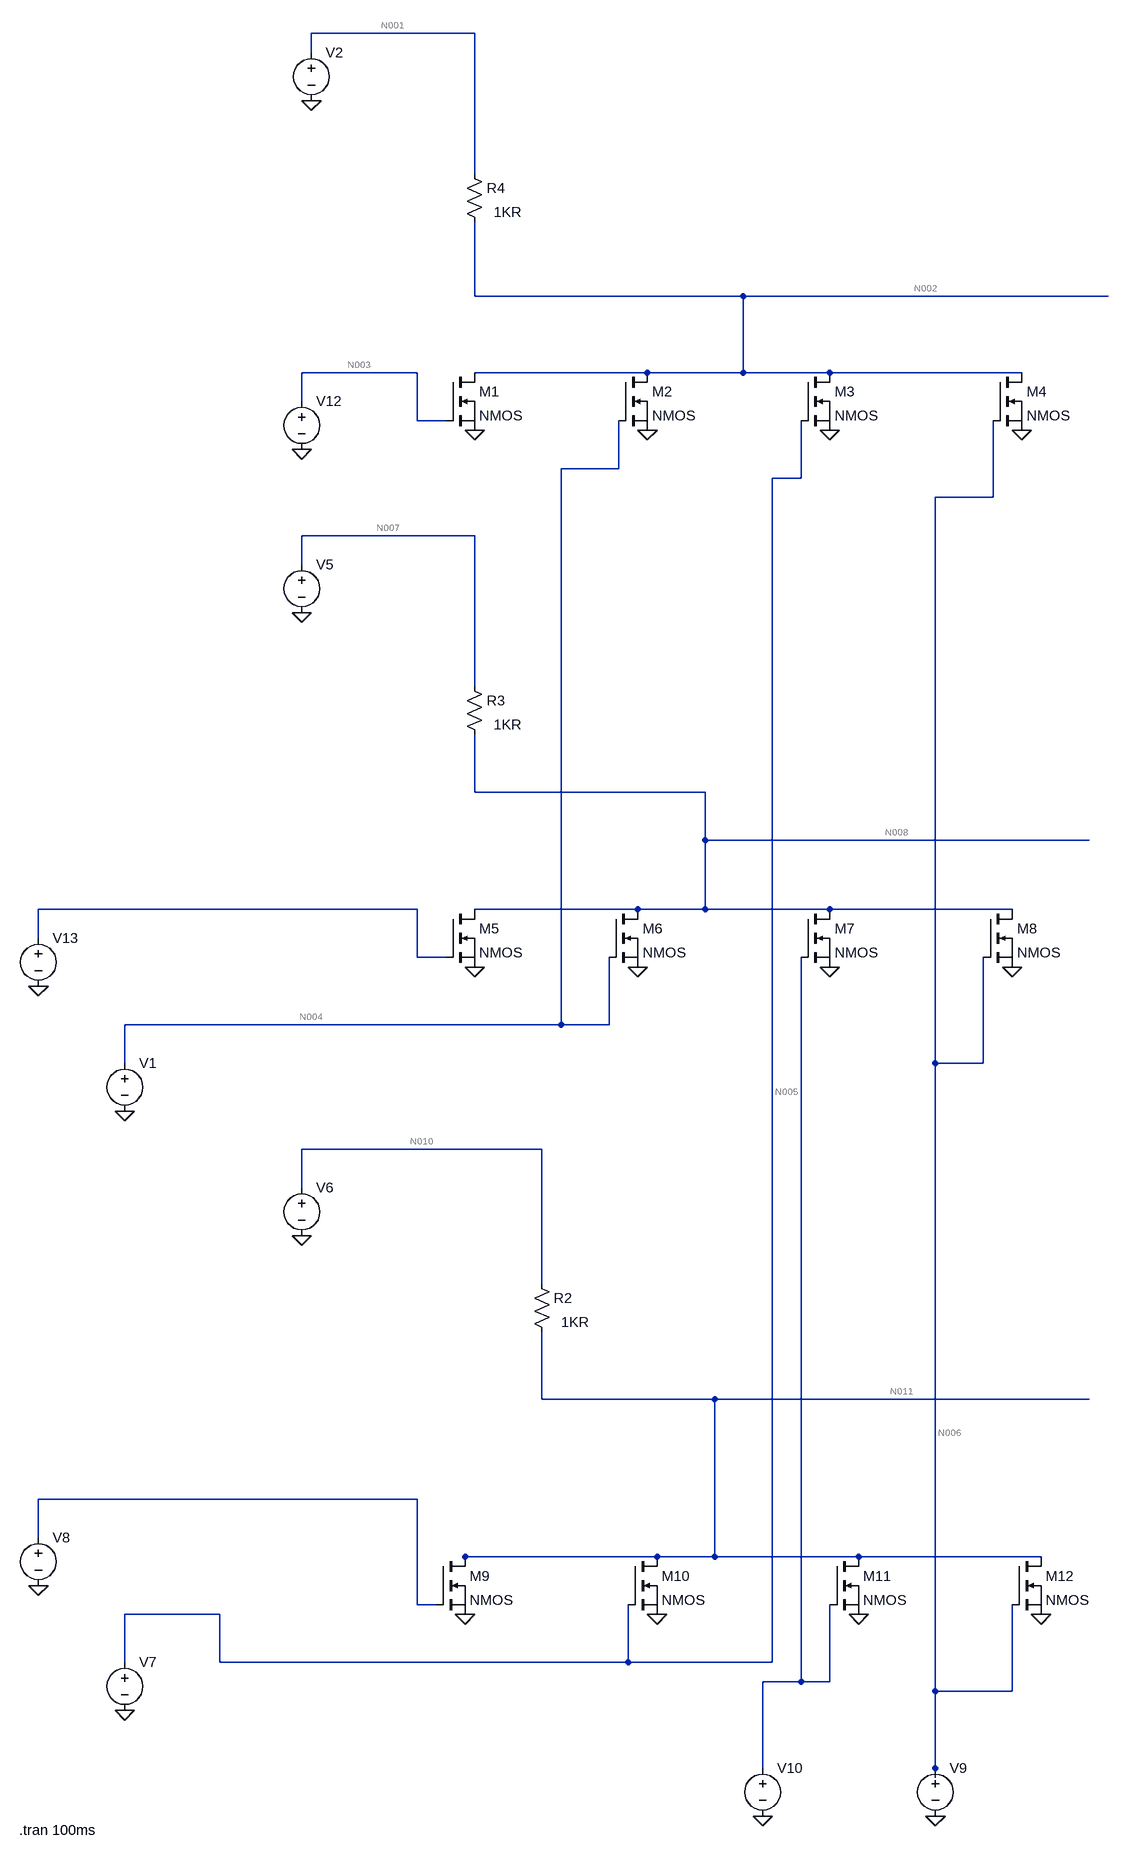
[diagram p0: schematic nmos.asc]
nmos.asc, the LTspice schematic file:
Version 4
SHEET 1 3732 3000
WIRE -1248 -656 -1520 -656
WIRE -1520 -624 -1520 -656
WIRE -1248 -272 -1248 -656
WIRE -1248 64 -1248 -192
WIRE -800 64 -1248 64
WIRE -192 64 -800 64
WIRE -1344 256 -1536 256
WIRE -960 256 -1248 256
WIRE -800 256 -800 64
WIRE -800 256 -960 256
WIRE -656 256 -800 256
WIRE -336 256 -656 256
WIRE -1536 304 -1536 256
WIRE -1344 336 -1344 256
WIRE -1296 336 -1344 336
WIRE -1008 416 -1008 336
WIRE -1008 416 -1104 416
WIRE -704 432 -704 336
WIRE -704 432 -752 432
WIRE -384 464 -384 336
WIRE -384 464 -480 464
WIRE -1248 528 -1536 528
WIRE -1536 576 -1536 528
WIRE -1248 864 -1248 528
WIRE -1248 1040 -1248 944
WIRE -864 1040 -1248 1040
WIRE -864 1120 -864 1040
WIRE -224 1120 -864 1120
WIRE -1344 1264 -2080 1264
WIRE -976 1264 -1248 1264
WIRE -864 1264 -864 1120
WIRE -864 1264 -976 1264
WIRE -656 1264 -864 1264
WIRE -352 1264 -656 1264
WIRE -2080 1312 -2080 1264
WIRE -1344 1344 -1344 1264
WIRE -1296 1344 -1344 1344
WIRE -1104 1456 -1104 416
WIRE -1104 1456 -1936 1456
WIRE -1024 1456 -1024 1344
WIRE -1024 1456 -1104 1456
WIRE -1936 1520 -1936 1456
WIRE -480 1520 -480 464
WIRE -400 1520 -400 1344
WIRE -400 1520 -480 1520
WIRE -1136 1664 -1536 1664
WIRE -1536 1728 -1536 1664
WIRE -1136 1888 -1136 1664
WIRE -1136 2080 -1136 1968
WIRE -848 2080 -1136 2080
WIRE -224 2080 -848 2080
WIRE -1344 2432 -2080 2432
WIRE -2080 2496 -2080 2432
WIRE -944 2528 -1264 2528
WIRE -848 2528 -848 2080
WIRE -848 2528 -944 2528
WIRE -608 2528 -848 2528
WIRE -304 2528 -608 2528
WIRE -1264 2544 -1264 2528
WIRE -1344 2608 -1344 2432
WIRE -1312 2608 -1344 2608
WIRE -1776 2624 -1936 2624
WIRE -1936 2704 -1936 2624
WIRE -1776 2704 -1776 2624
WIRE -992 2704 -992 2608
WIRE -992 2704 -1776 2704
WIRE -752 2704 -752 432
WIRE -752 2704 -992 2704
WIRE -704 2736 -704 1344
WIRE -704 2736 -768 2736
WIRE -656 2736 -656 2608
WIRE -656 2736 -704 2736
WIRE -480 2752 -480 1520
WIRE -352 2752 -352 2608
WIRE -352 2752 -480 2752
WIRE -768 2880 -768 2736
WIRE -480 2880 -480 2752
WIRE -480 2896 -480 2880
FLAG -2080 1392 0
FLAG -1936 1600 0
FLAG -1536 1808 0
FLAG -1248 1360 0
FLAG -976 1360 0
FLAG -656 1360 0
FLAG -1536 384 0
FLAG -1248 352 0
FLAG -960 352 0
FLAG -656 352 0
FLAG -336 352 0
FLAG -1520 -544 0
FLAG -2080 2576 0
FLAG -1936 2784 0
FLAG -768 2960 0
FLAG -480 2960 0
FLAG -304 2624 0
FLAG -608 2624 0
FLAG -944 2624 0
FLAG -1264 2624 0
FLAG -352 1360 0
FLAG -1536 656 0
SYMBOL nmos -1296 256 R0
SYMATTR InstName M1
SYMBOL nmos -1008 256 R0
SYMATTR InstName M2
SYMBOL nmos -704 256 R0
SYMATTR InstName M3
SYMBOL nmos -384 256 R0
SYMATTR InstName M4
SYMBOL nmos -1296 1264 R0
SYMATTR InstName M5
SYMBOL nmos -1024 1264 R0
SYMATTR InstName M6
SYMBOL nmos -704 1264 R0
SYMATTR InstName M7
SYMBOL nmos -400 1264 R0
SYMATTR InstName M8
SYMBOL nmos -1312 2528 R0
SYMATTR InstName M9
SYMBOL nmos -992 2528 R0
SYMATTR InstName M10
SYMBOL nmos -656 2528 R0
SYMATTR InstName M11
SYMBOL nmos -352 2528 R0
SYMATTR InstName M12
SYMBOL voltage -1936 1504 R0
WINDOW 3 24 96 Invisible 2
WINDOW 123 0 0 Left 0
WINDOW 39 0 0 Left 0
SYMATTR Value PULSE(0 1.8 24ms 0 0 10ms 100ms 1)
SYMATTR InstName V1
SYMBOL voltage -1520 -640 R0
WINDOW 3 24 96 Invisible 2
WINDOW 123 0 0 Left 0
WINDOW 39 0 0 Left 0
SYMATTR Value -1.8
SYMATTR InstName V2
SYMBOL voltage -1536 560 R0
WINDOW 3 24 96 Invisible 2
WINDOW 123 0 0 Left 0
WINDOW 39 0 0 Left 0
SYMATTR Value -1.8
SYMATTR InstName V5
SYMBOL voltage -1536 1712 R0
WINDOW 3 24 96 Invisible 2
WINDOW 123 0 0 Left 0
WINDOW 39 0 0 Left 0
SYMATTR Value -1.8
SYMATTR InstName V6
SYMBOL voltage -1936 2688 R0
WINDOW 3 24 96 Invisible 2
WINDOW 123 0 0 Left 0
WINDOW 39 0 0 Left 0
SYMATTR Value PULSE(0 1.8 48ms 0 0 10ms 100ms 1)
SYMATTR InstName V7
SYMBOL voltage -2080 2480 R0
WINDOW 3 24 96 Invisible 2
WINDOW 123 0 0 Left 0
WINDOW 39 0 0 Left 0
SYMATTR Value PULSE(0 1.8 36ms 0 0 10ms 100ms 1)
SYMATTR InstName V8
SYMBOL voltage -480 2864 R0
WINDOW 3 24 96 Invisible 2
WINDOW 123 0 0 Left 0
WINDOW 39 0 0 Left 0
SYMATTR Value PULSE(0 1.8 72ms 0 0 10ms 100ms 1)
SYMATTR InstName V9
SYMBOL voltage -768 2864 R0
WINDOW 3 24 96 Invisible 2
WINDOW 123 0 0 Left 0
WINDOW 39 0 0 Left 0
SYMATTR Value PULSE(0 1.8 60ms 0 0 10ms 100ms 1)
SYMATTR InstName V10
SYMBOL voltage -1536 288 R0
WINDOW 3 24 96 Invisible 2
WINDOW 123 0 0 Left 0
WINDOW 39 0 0 Left 0
SYMATTR Value PULSE(0 1.8 0 0 0 10ms 100ms 1)
SYMATTR InstName V12
SYMBOL voltage -2080 1296 R0
WINDOW 3 24 96 Invisible 2
WINDOW 123 0 0 Left 0
WINDOW 39 0 0 Left 0
SYMATTR Value PULSE(0 1.8 12ms 0 0 10ms 100ms 1)
SYMATTR InstName V13
SYMBOL res -1152 1872 R0
WINDOW 3 48 80 Left 2
SYMATTR Value 1KR
SYMATTR InstName R2
SYMBOL res -1264 848 R0
WINDOW 3 48 80 Left 2
SYMATTR Value 1KR
SYMATTR InstName R3
SYMBOL res -1264 -288 R0
WINDOW 3 48 80 Left 2
SYMATTR Value 1KR
SYMATTR InstName R4
TEXT -2112 2984 Left 2 !.tran 100ms

The netlist it stands for:
* nmos.asc
M1 N002 N003 0 0 NMOS
M2 N002 N004 0 0 NMOS
M3 N002 N005 0 0 NMOS
M4 N002 N006 0 0 NMOS
M5 N008 N009 0 0 NMOS
M6 N008 N004 0 0 NMOS
M7 N008 N013 0 0 NMOS
M8 N008 N006 0 0 NMOS
M9 N011 N012 0 0 NMOS
M10 N011 N005 0 0 NMOS
M11 N011 N013 0 0 NMOS
M12 N011 N006 0 0 NMOS
V1 N004 0 PULSE(0 1.8 24ms 0 0 10ms 100ms 1)
V2 N001 0 -1.8
V5 N007 0 -1.8
V6 N010 0 -1.8
V7 N005 0 PULSE(0 1.8 48ms 0 0 10ms 100ms 1)
V8 N012 0 PULSE(0 1.8 36ms 0 0 10ms 100ms 1)
V9 N006 0 PULSE(0 1.8 72ms 0 0 10ms 100ms 1)
V10 N013 0 PULSE(0 1.8 60ms 0 0 10ms 100ms 1)
V12 N003 0 PULSE(0 1.8 0 0 0 10ms 100ms 1)
V13 N009 0 PULSE(0 1.8 12ms 0 0 10ms 100ms 1)
R2 N010 N011 1KR
R3 N007 N008 1KR
R4 N001 N002 1KR
.model NMOS NMOS
.model PMOS PMOS
.lib standard.mos
.tran 100ms
.backanno
.end

* Results of the author's LTspice run, read from the files saved beside the schematic
* Operating Point, zero values left out:
*   V(n002) = -623.1 mV
*   V(n008) = -623.1 mV
*   V(n011) = -623.1 mV
*   V(n001) = -1.8 V
*   V(n007) = -1.8 V
*   V(n010) = -1.8 V
*   Id(M1) = -294.2 µA
*   Ib(M1) = 290.3 µA
*   Is(M1) = 3.883 µA
*   Id(M2) = -294.2 µA
*   Ib(M2) = 290.3 µA
*   Is(M2) = 3.883 µA
*   Id(M3) = -294.2 µA
*   Ib(M3) = 290.3 µA
*   Is(M3) = 3.883 µA
*   Id(M4) = -294.2 µA
*   Ib(M4) = 290.3 µA
*   Is(M4) = 3.883 µA
*   Id(M5) = -294.2 µA
*   Ib(M5) = 290.3 µA
*   Is(M5) = 3.883 µA
*   Id(M6) = -294.2 µA
*   Ib(M6) = 290.3 µA
*   Is(M6) = 3.883 µA
*   Id(M7) = -294.2 µA
*   Ib(M7) = 290.3 µA
*   Is(M7) = 3.883 µA
*   Id(M8) = -294.2 µA
*   Ib(M8) = 290.3 µA
*   Is(M8) = 3.883 µA
*   Id(M9) = -294.2 µA
*   Ib(M9) = 290.3 µA
*   Is(M9) = 3.883 µA
*   Id(M10) = -294.2 µA
*   Ib(M10) = 290.3 µA
*   Is(M10) = 3.883 µA
*   Id(M11) = -294.2 µA
*   Ib(M11) = 290.3 µA
*   Is(M11) = 3.883 µA
*   Id(M12) = -294.2 µA
*   Ib(M12) = 290.3 µA
*   Is(M12) = 3.883 µA
*   I(R2) = -1.177 mA
*   I(R3) = -1.177 mA
*   I(R4) = -1.177 mA
*   I(V2) = 1.177 mA
*   I(V5) = 1.177 mA
*   I(V6) = 1.177 mA
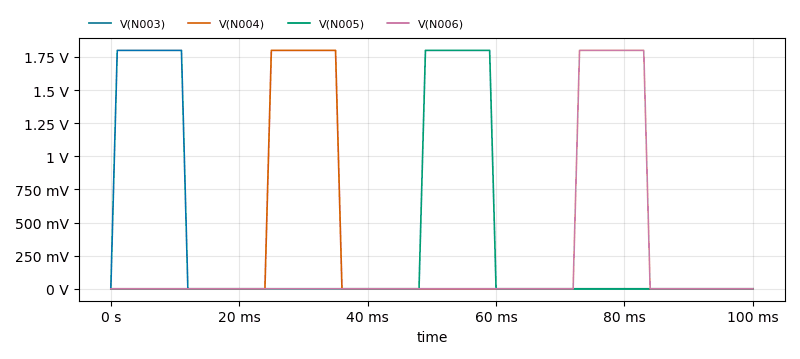
[diagram p1: Transient Analysis of nmos.asc, plotted from the saved traces]
* Transient Analysis, 1 run:
*   V(N003): min 0 V, max 1.8 V, average 198 mV, rms 597 mV, last 0 V
*   V(N004): min 0 V, max 1.8 V, average 198 mV, rms 597 mV, last 0 V
*   V(N005): min 0 V, max 1.8 V, average 198 mV, rms 597 mV, last 0 V
*   V(N006): min 0 V, max 1.8 V, average 198 mV, rms 597 mV, last 0 V